# Altium schematic sheet ESP321_Sheet_1_updated_2.schdoc
size 599 x 426 mm; Name: A_A2; Symbol: A_A2; Device: A_A2; @Project Name: Review_2; REV: 1.0; Date: 2025-09-14; Sheet: 1/1; Draw By: hemakanth_n; Company: Grelien; Convert to PCB: yes; Add into BOM: yes; spicePre: .; @Page No: 1; @Page Count: 1; @Schematic Name: ESP32; @Board Name: ESP32; @Update Date: 2025-11-10; @Create Time: 06:48:16; @Update Time: 12:18:23; @Page Name: Sheet_1; @Create Date: 2025-11-10
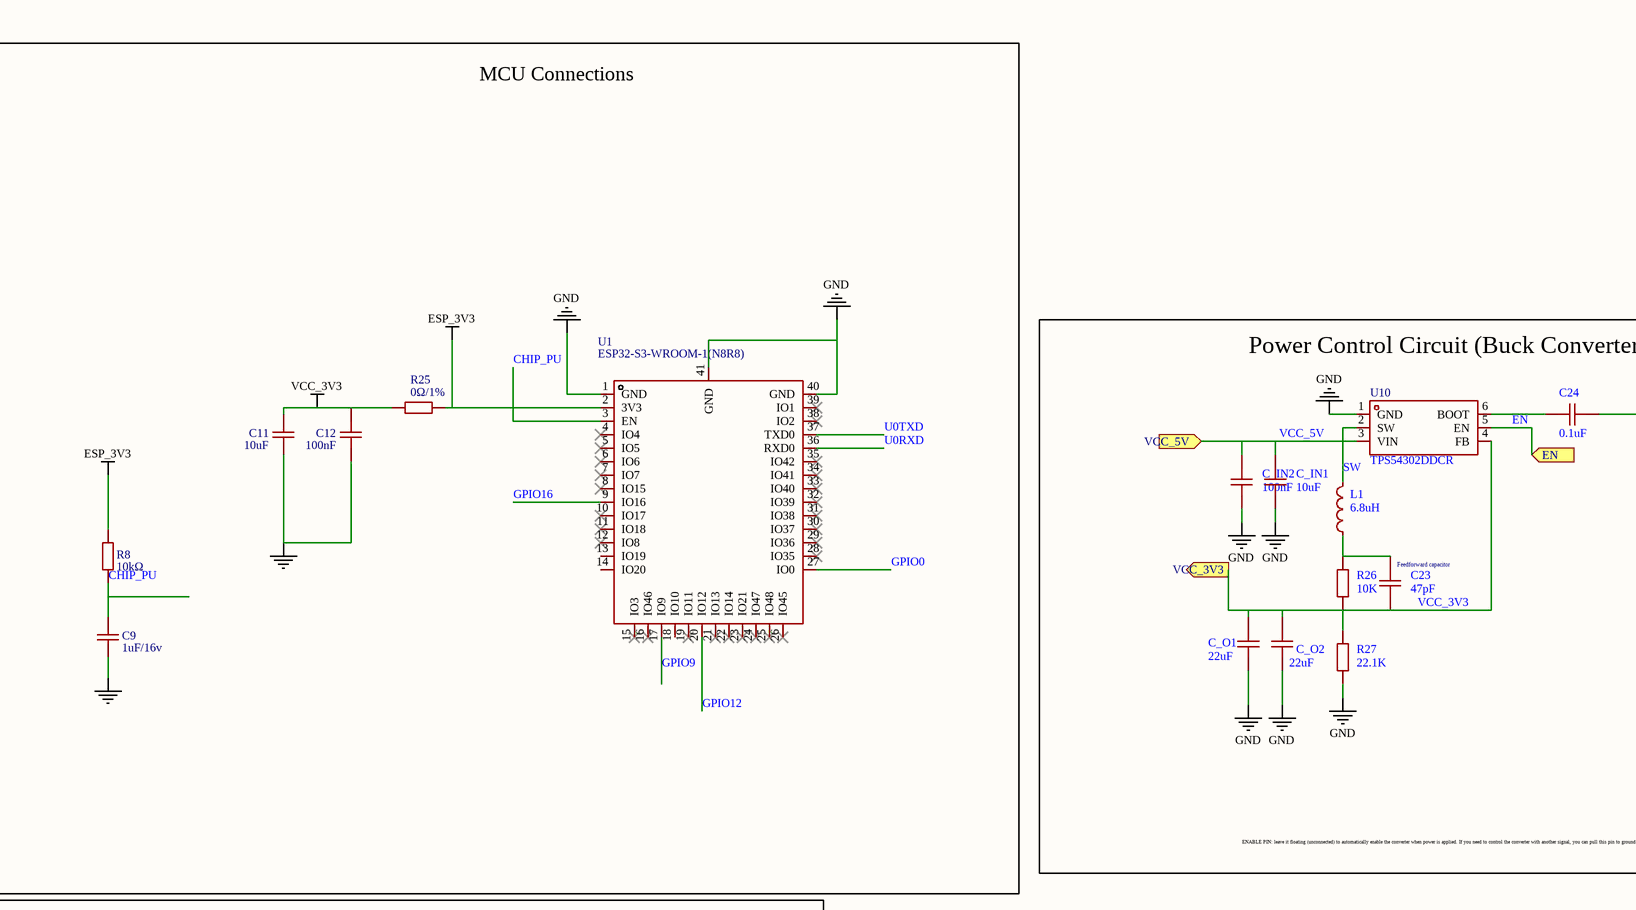
[diagram p0: ESP321_Sheet_1_updated_2.schdoc, top left]
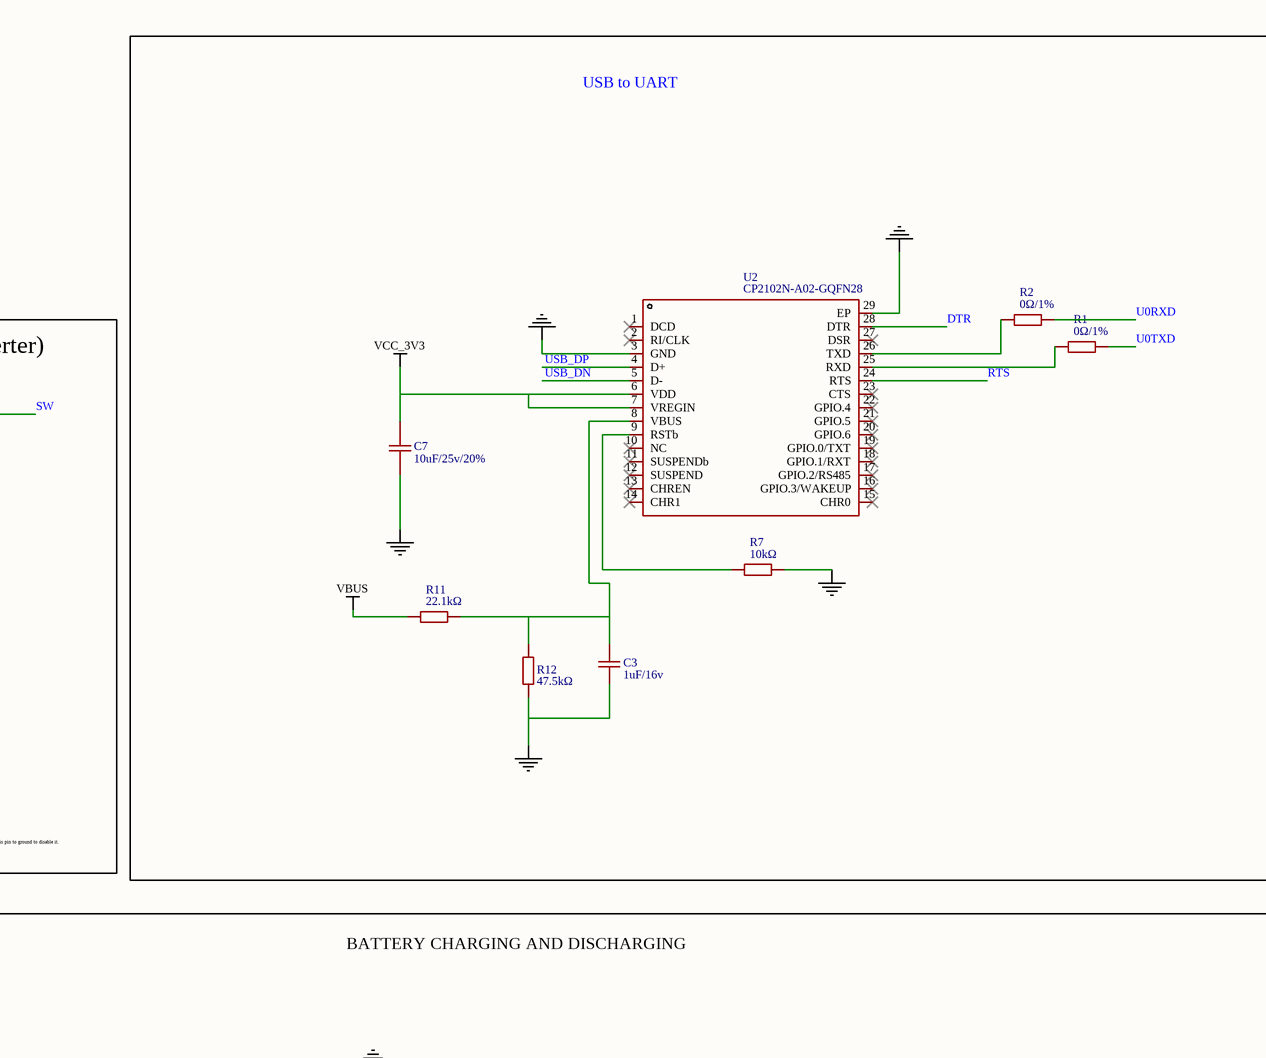
[diagram p1: ESP321_Sheet_1_updated_2.schdoc, top right]
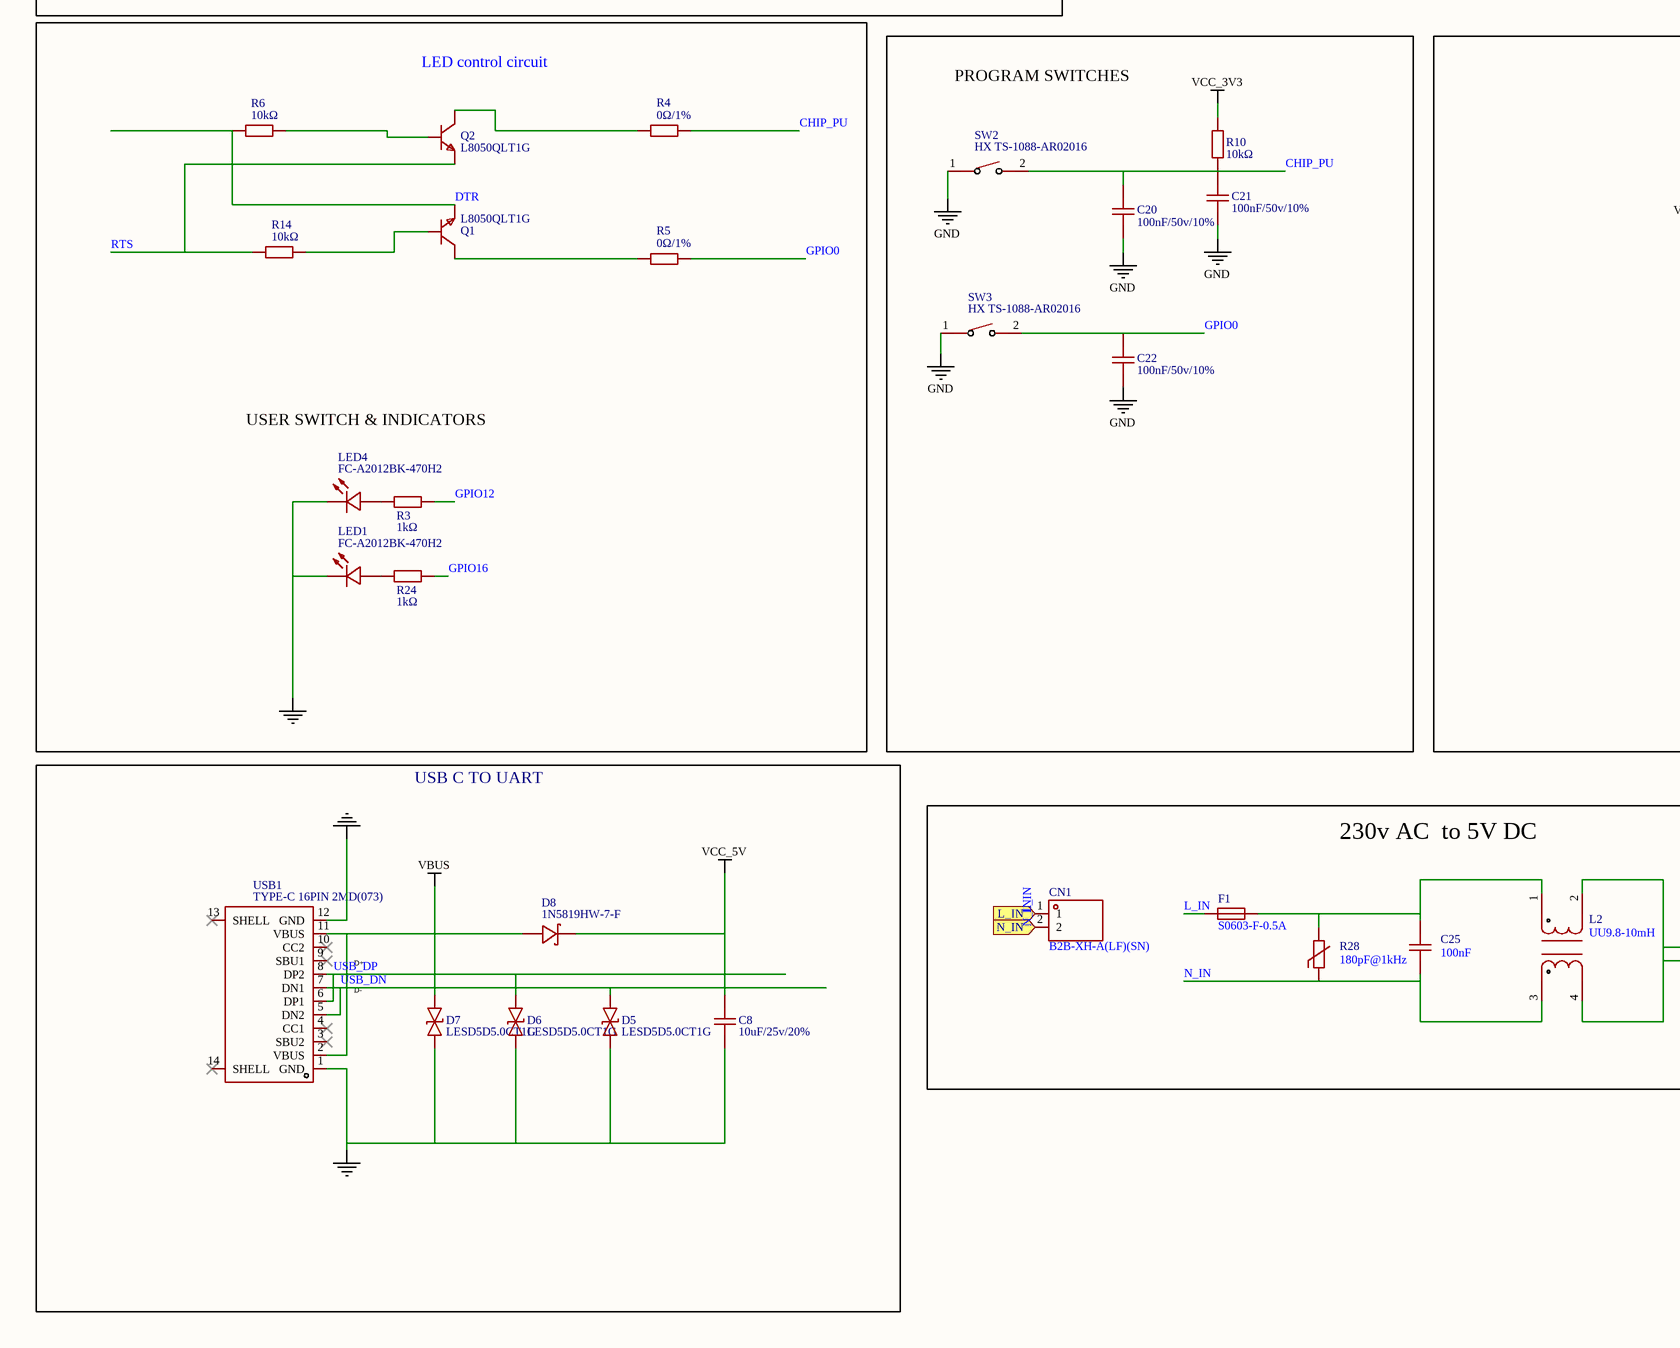
[diagram p2: ESP321_Sheet_1_updated_2.schdoc, bottom left]
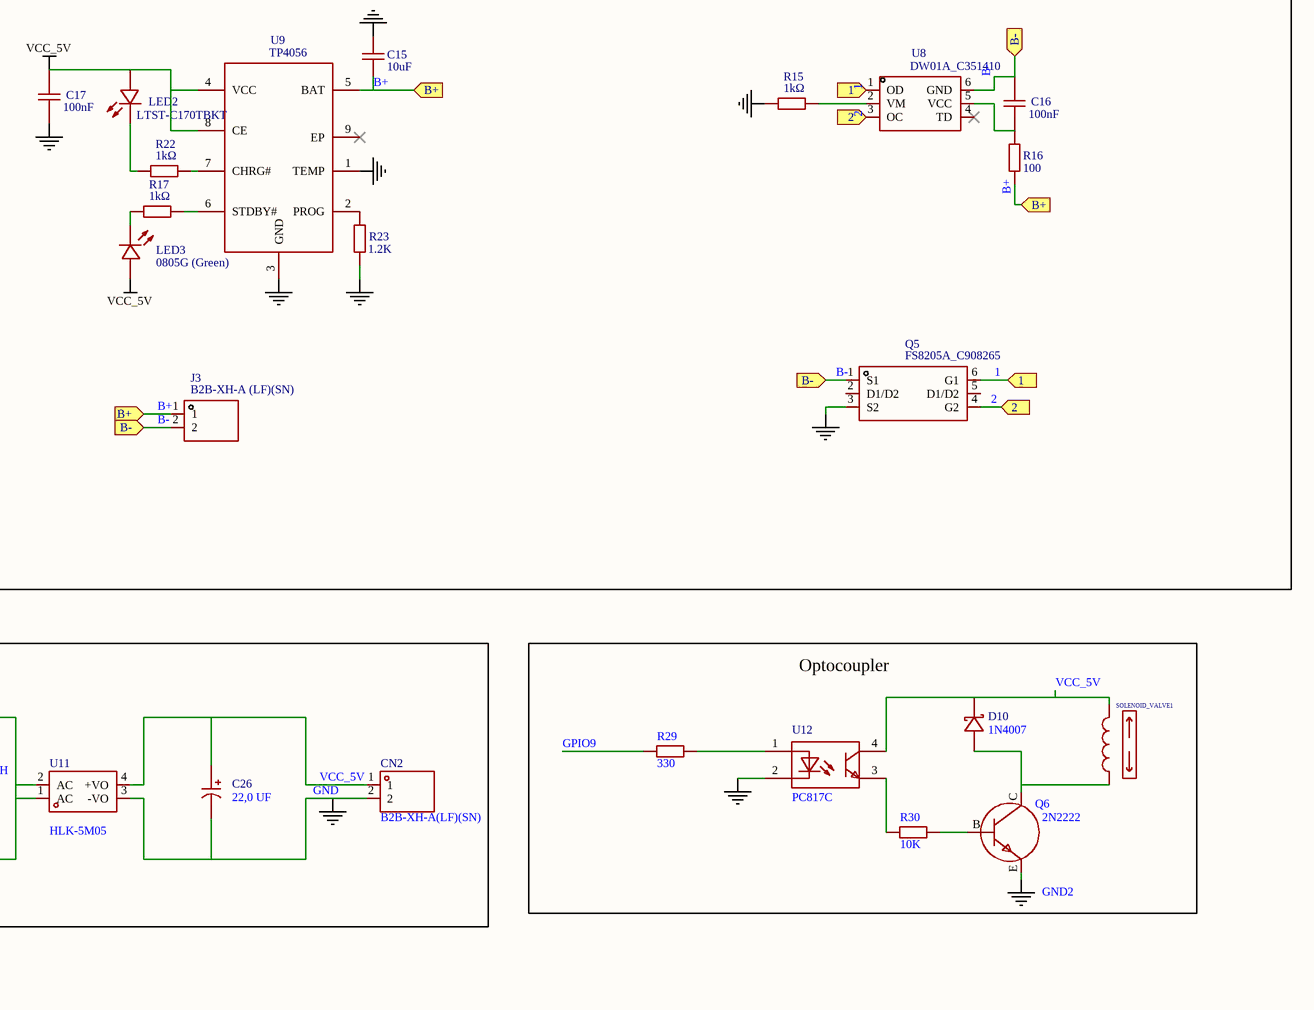
[diagram p3: ESP321_Sheet_1_updated_2.schdoc, bottom right]

## Parts
C3  1uF/16v  [C0402]
C7  10uF/25v/20%  [C0603]
C8  10uF/25v/20%  [C0603]
C9  1uF/16v  [C0402]
C11  10uF  [C0402]
C12  100nF  [C0402]
C15  10uF  [C0402]
C16  100nF  [C0402]
C17  100nF  [C0402]
C20  100nF/50v/10%  [C0402]
C21  100nF/50v/10%  [C0402]
C22  100nF/50v/10%  [C0402]
C23  47pF  [C0603]
C24  0.1uF  [C0603]
C25  100nF  [CAP-TH_L10.0-W5.0-P7.50-D0.6]
C26  22,0 UF  [CAP-TH_BD10.0-P5.00-D0.6-FD]
C_IN1  10uF  [C0603]
C_IN2  100nF  [C0603]
C_O1  22uF  [C0603]
C_O2  22uF  [C0603]
CN1  B2B-XH-A(LF)(SN)  [CONN-TH_B2B-XH-A-LF-SN]
CN2  B2B-XH-A(LF)(SN)  [CONN-TH_B2B-XH-A-LF-SN]
D5  LESD5D5.0CT1G  [SOD-523_L1.2-W0.8-LS1.6-BI]
D6  LESD5D5.0CT1G  [SOD-523_L1.2-W0.8-LS1.6-BI]
D7  LESD5D5.0CT1G  [SOD-523_L1.2-W0.8-LS1.6-BI]
D8  1N5819HW-7-F  [SOD-123_L2.7-W1.6-LS3.7-RD]
D10  1N4007  [SOD-57_BD3.8-L4.6-P9.00-D0.8-RD]
F1  S0603-F-0.5A  [F0603]
J3  B2B-XH-A (LF)(SN)  [CONN-TH_B2B-XH-A-LF-SN]
L1  6.8uH  [L0603]
L2  UU9.8-10mH  [FILTER-TH_4P-L16.5-W11.5-P8.00-D0.6-S7.00]
LED1  FC-A2012BK-470H2  [LED0805-R-RD]
LED2  LTST-C170TBKT  [LED0805-RD_BLUE]
LED3  0805G (Green)  [LED0805-RD_GREEN]
LED4  FC-A2012BK-470H2  [LED0805-R-RD]
Q1  L8050QLT1G  [SOT-23-3_L2.9-W1.3-P1.90-LS2.4-BR]
Q2  L8050QLT1G  [SOT-23-3_L2.9-W1.3-P1.90-LS2.4-BR]
Q5  FS8205A_C908265  [SOT-23-6_L2.9-W1.6-P0.95-LS2.8-BR]
Q6  2N2222  [TO-18]
R1  0Ω/1%  [R0402]
R2  0Ω/1%  [R0402]
R3  1kΩ  [R0402]
R4  0Ω/1%  [R0402]
R5  0Ω/1%  [R0402]
R6  10kΩ  [R0402]
R7  10kΩ  [R0402]
R8  10kΩ  [R0402]
R10  10kΩ  [R0402]
R11  22.1kΩ  [R0402]
R12  47.5kΩ  [R0402]
R14  10kΩ  [R0402]
R15  1kΩ  [R0402]
R16  100  [R0603]
R17  1kΩ  [R0402]
R22  1kΩ  [R0402]
R23  1.2K  [R0603]
R24  1kΩ  [R0402]
R25  0Ω/1%  [R0402]
R26  10K  [R0603]
R27  22.1K  [R0603]
R28  180pF@1kHz  [RES-SMD_10D561K]
R29  330  [R0603]
R30  10K  [R0603]
SOLENOID_VALVE1  (no value)
SW2  HX TS-1088-AR02016  [SW-SMD_L4.0-W2.9-LS5.0]
SW3  HX TS-1088-AR02016  [SW-SMD_L4.0-W2.9-LS5.0]
U1  ESP32-S3-WROOM-1(N8R8)  [WIRELM-SMD_ESP32-S3-WROOM-1]
U2  CP2102N-A02-GQFN28  [QFN-28_L5.0-W5.0-P0.50-TL-EP3.3]
U8  DW01A_C351410  [SOT-23-6_L2.9-W1.6-P0.95-LS2.8-BL]
U9  TP4056  [ESOP-8_L4.9-W3.9-P1.27-LS6.0-BL-EP]
U10  TPS54302DDCR  [SOT-23-6_L2.9-W1.6-P0.95-LS2.8-BL]
U11  HLK-5M05  [PWRM-TH_HLK-5M05]
U12  PC817C  [DIP-4_L4.6-W6.5-P2.54-LS7.6-BL]
USB1  TYPE-C 16PIN 2MD(073)  [USB-C-SMD_TYPE-C-6PIN-2MD-073]

## Blocks framed on the sheet
MCU Connections: C9 C11 C12 R8 R25 U1
USB to UART: C3 C7 R1 R2 R7 R11 R12 U2
Power Control Circuit (Buck Converter): C23 C24 C_IN1 C_IN2 C_O1 C_O2 L1 R26 R27 U10
USER SWITCH & INDICATORS: LED1 LED4 Q1 Q2 R3-R6 R14 R24
PROGRAM SWITCHES: C20-C22 R10 SW2 SW3
BATTERY CHARGING AND DISCHARGING: C15-C17 J3 LED2 LED3 Q5 R15-R17 R22 R23 U8 U9
USB C TO UART: C8 D5-D8 USB1
230v AC  to 5V DC: C25 C26 CN1 CN2 F1 L2 R28 U11
Optocoupler: D10 Q6 R29 R30 SOLENOID_VALVE1 U12

## Ports
1 (in), 2 (in), B+ (in), B- (in), EN (in), L_IN (in), N_IN (in), VCC_3V3 (out), VCC_5V (in)

## Nets
ESP_3V3: R8.2 R25.2 U1.2(3V3)
GND: C3.1 C7.1 C8.1 C9.1 C11.2 C12.1 C15.2 C17.1 C20.2 C21.2 C22.1 C26.2 C_IN1.2 C_IN2.2 C_O1.1 C_O2.2 CN2.2 D5.1 D6.1 D7.1 LED1.2(-) LED4.2(-) Q5.3(S2) Q6.E R7.2 R12.1 R15.1 R23.1 R27.1 SW2.1 SW3.1 U1.1(GND) U1.40(GND) U1.41(GND) U2.3(GND) U2.29(EP) U9.1(TEMP) U9.3(GND) U10.1(GND) U11.3(-VO) U12.2(CAT) USB1.1(GND) USB1.12(GND)
VBUS: D7.2 D8.2(A) R11.1 USB1.2(VBUS) USB1.11(VBUS)
VCC_3V3: C7.2 C11.1 C12.2 C23.2 C_O1.2 C_O2.1 R10.2 R25.1 R26.1 R27.2 U2.6(VDD) U2.7(VREGIN) U10.4(FB) ; port VCC_3V3
VCC_5V: C8.2 C17.2 C26.1 C_IN1.1 C_IN2.1 CN2.1 D8.1(K) D10.1(K) LED2.2(A) LED3.2(A) SOLENOID_VALVE1.1 U9.4(VCC) U9.8(CE) U10.3(VIN) U11.4(+VO) U12.4(COL) ; port VCC_5V
1: Q5.6(G1) U8.1(OD) ; port 1
2: Q5.4(G2) U8.3(OC) ; port 2
B+: C15.1 J3.1 R16.1 U9.5(BAT) ; port B+
B-: C16.2 J3.2 Q5.1(S1) U8.6(GND) ; port B-
CHIP_PU: C9.2 C20.1 C21.1 R4.2 R8.1 R10.1 SW2.2 U1.3(EN)
DTR: Q1.2(E) R6.1 U2.28(DTR)
EN: U10.5(EN) ; port EN
GPIO0: C22.2 R5.2 SW3.2 U1.27(IO0)
GPIO9: R29.1 U1.17(IO9)
GPIO12: R3.2 U1.20(IO12)
GPIO16: R24.2 U1.9(IO16)
L_IN: CN1.1 F1.1 ; port L_IN
N_IN: C25.1 CN1.2 L2.3 R28.1 ; port N_IN
RTS: Q2.2(E) R14.1 U2.24(RTS)
SW: C24.2 L1.2 U10.2(SW)
U0RXD: R2.2 U1.36(RXD0)
U0TXD: R1.2 U1.37(TXD0)
USB_DN: D5.2 U2.5(D-) USB1.5(DN2) USB1.7(DN1)
USB_DP: D6.2 U2.4(D+) USB1.6(DP1) USB1.8(DP2)
NetC3_2: C3.2 R11.2 R12.2 U2.8(VBUS)
NetC16_1: C16.1 R16.2 U8.5(VCC)
NetC23_1: C23.1 L1.1 R26.2
NetC24_1: C24.1 U10.6(BOOT)
NetC25_2: C25.2 F1.2 L2.1 R28.2
NetD10_2: D10.2(A) Q6.C SOLENOID_VALVE1.2
NetL2_2: L2.2 L2.4 U11.1(AC) U11.2(AC)
NetLED1_1: LED1.1(+) R24.1
NetLED2_1: LED2.1(K) R22.1
NetLED3_1: LED3.1(K) R17.1
NetLED4_1: LED4.1(+) R3.1
NetQ1_1: Q1.1(B) R14.2
NetQ1_3: Q1.3(C) R5.1
NetQ2_1: Q2.1(B) R6.2
NetQ2_3: Q2.3(C) R4.1
NetQ6_B: Q6.B R30.2
NetR1_1: R1.1 U2.25(RXD)
NetR2_1: R2.1 U2.26(TXD)
NetR7_1: R7.1 U2.9(RSTb)
NetR15_2: R15.2 U8.2(VM)
NetR17_2: R17.2 U9.6(STDBY#)
NetR22_2: R22.2 U9.7(CHRG#)
NetR23_2: R23.2 U9.2(PROG)
NetR29_2: R29.2 U12.1(AN)
NetR30_1: R30.1 U12.3(EM)

Not connected (* = marked no-connect by the designer): Q5 2(D1/D2) 5(D1/D2); U1 4(IO4)* 5(IO5)* 6(IO6)* 7(IO7)* 8(IO15)* 10(IO17)* 11(IO18)* 12(IO8)* 13(IO19) 14(IO20) 15(IO3)* 16(IO46)* 18(IO10) 19(IO11)* 21(IO13)* 22(IO14)* 23(IO21)* 24(IO47)* 25(IO48)* 26(IO45)* 28(IO35)* 29(IO36)* 30(IO37)* 31(IO38)* 32(IO39)* 33(IO40)* 34(IO41)* 35(IO42)* 38(IO2)* 39(IO1)*; U2 1(DCD)* 2(RI/CLK)* 10(NC)* 11(SUSPENDb)* 12(SUSPEND)* 13(CHREN)* 14(CHR1)* 15(CHR0)* 16(GPIO.3/WAKEUP)* 17(GPIO.2/RS485)* 18(GPIO.1/RXT)* 19(GPIO.0/TXT)* 20(GPIO.6)* 21(GPIO.5)* 22(GPIO.4)* 23(CTS)* 27(DSR)*; U8 4(TD)*; U9 9(EP)*; USB1 3(SBU2)* 4(CC1)* 9(SBU1)* 10(CC2)* 13(SHELL)* 14(SHELL)*

## Notes on the sheet
- (near C23) Feedforward capacitor
- ENABLE PIN: leave it floating (unconnected) to automatically enable the converter when power is applied. If you need to control the converter with another signal, you can pull this pin to ground to disable it.
- (near Q2) LED control circuit
- (near USB1) D+
- (near USB1) D-
- (near Q6) GND2
- Convert to PCB
- Add into BOM
- 1
- 2
- 3
- 4
- 5
- 6
- 7
- 8
- 9
- 10
- 11
- A
- B
- C
- D
- E
- F
- G
- H
- TITLE:
- Review_2
- REV:
- 1.0
- Date:
- Company:
- 2025-09-14
- Grelien
- Drawn By:
- hemakanth_n
- Sheet:
- 1/1

## Library data of the parts
C3 C9 = 1uF/16v: Manufacturer Part: CL05A105KO5NNNC; Manufacturer: SAMSUNG(三星); Convert to PCB: yes; nameAlias: Value; Symbol: 1uF/16v; Device: 1uF/16v; Supplier: LCSC; Supplier Part: C29266; JLCPCB Part Class: Extended Part; Add into BOM: yes; Origin Footprint: C0402; spicePre: C; spiceSymbolName: CL05A105KO5NNNC
C7 C8 = 10uF/25v/20%: Manufacturer: SAMSUNG(三星); Manufacturer Part: CL10A106MA8NRNC; Convert to PCB: yes; nameAlias: Value; Symbol: 10uF/25v/20%; Device: 10uF/25v/20%; Supplier: LCSC; Supplier Part: C96446; JLCPCB Part Class: Basic Part; Add into BOM: yes; Origin Footprint: C0603; spicePre: C; spiceSymbolName: CL10A106MA8NRNC
C11 C15 = 10uF: Manufacturer Part: CL05A106MQ5NUNC; Manufacturer: SAMSUNG(三星); Convert to PCB: yes; nameAlias: Value; Symbol: 10uF; Device: 10uF; Supplier: LCSC; Supplier Part: C15525; JLCPCB Part Class: Basic Part; Add into BOM: yes; Origin Footprint: C0402; spicePre: C; spiceSymbolName: CL05A106MQ5NUNC
C12 C16 C17 = 100nF: Manufacturer Part: CL05B104KO5NNNC; Manufacturer: SAMSUNG(三星); Convert to PCB: yes; nameAlias: Value; Symbol: 100nF; Device: 100nF; Supplier: LCSC; Supplier Part: C1525; JLCPCB Part Class: Basic Part; Add into BOM: yes; Origin Footprint: C0402; spicePre: C; spiceSymbolName: CL05B104KO5NNNC
C20-C22 = 100nF/50v/10%: Manufacturer: SAMSUNG(三星); Manufacturer Part: CL05B104KB54PNC; Convert to PCB: yes; nameAlias: Value; Contributor: LCSC; Symbol: 100nF/50v/10%; Device: 100nF/50v/10%; Supplier: LCSC; Supplier Part: C307331; JLCPCB Part Class: Basic Part; Add into BOM: yes; Origin Footprint: C0402; spicePre: C; spiceSymbolName: CL05B104KB54PNC
C23 C24 C_IN1 C_IN2 C_O1 C_O2 = CAP_0603: Symbol: CAP; Convert to PCB: yes; Device: CAP_0603; Add into BOM: yes; Supplier Footprint: 0603
  C23: Value: 47pF
  C24: Value: 0.1uF
  C_IN1: Value: 10uF
  C_IN2: Value: 100nF
  C_O1 C_O2: Value: 22uF
C25 = X2-104K-275VAC: Manufacturer: NDF(达孚); Add into BOM: yes; Tolerance: ±10%; Voltage(AC): 275V; Ratings: X2; Symbol: X2-104K-275VAC; Device: X2-104K-275VAC; LCSC Part Name: 等级:X2 100nF ±10% 275V; Supplier Part: C914482; Manufacturer Part: X2-104K-275VAC; Supplier Footprint: 插件,P=7.5mm; JLCPCB Part Class: Extended Part; Datasheet: https://item.szlcsc.com/datasheet/X2-104K-275VAC/985380.html; Supplier: LCSC; Convert to PCB: yes; Value: 100nF; Operating Temperature: -40℃~+110℃
C26 = BIPOLAR CAPACITOR 22,0 UF: Manufacturer: Visaton; Add into BOM: yes; Symbol: BIPOLAR CAPACITOR 22,0 UF; Device: BIPOLAR CAPACITOR 22,0 UF; LCSC Part Name: BIPOLAR CAPACITOR 22,0 UF; Supplier Part: C6131732; Manufacturer Part: 22,0 UF; Supplier Footprint: 插件,D10xL25.5mm; JLCPCB Part Class: Extended Part; Supplier: LCSC; Convert to PCB: yes
CN1 CN2 = B2B-XH-A(LF)(SN): Manufacturer: JST; Add into BOM: yes; Pins Structure: 1x2P; Pitch: 2.5mm; Reference Series: XH; Number of PINs Per Row: 2; Current Rating: 3A; Voltage Rating: 250V; Plastic Material: PA66; Flame Retardant Rating: UL94V-0; Supplementary Features: K Pin; Z-Height of the Board: 7mm; X-Length of Bottom Edge on Board (Spacing Line): 7.4mm; Y-Width of Bottom Edge on Board: 5.75mm; Symbol: B2B-XH-A (LF)(SN); Device: B2B-XH-A(LF)(SN); LCSC Part Name: 1x2P 间距:2.5mm 直插 系列:XH; Supplier Part: C158012; Manufacturer Part: B2B-XH-A(LF)(SN); Supplier Footprint: 插件,P=2.5mm; JLCPCB Part Class: Extended Part; Datasheet: https://item.szlcsc.com/datasheet/B2B-XH-A(LF)(SN)/169360.html; Supplier: LCSC; Convert to PCB: yes; Mounting Type: Through Hole; Number of Pins: 2P; Number of Rows: 1; Row Spacing: -; Contact Material: Brass; Contact Plating: Tin; Operating Temperature: -25℃~+85℃; Color: White
D5-D7 = LESD5D5.0CT1G: Manufacturer: LRC(乐山无线电); Convert to PCB: yes; Contributor: LCSC; Symbol: LESD5D5.0CT1G; Device: LESD5D5.0CT1G; Supplier: LCSC; Supplier Part: C383211; Manufacturer Part: LESD5D5.0CT1G; JLCPCB Part Class: Extended Part; Add into BOM: yes; Origin Footprint: SOD-523_L1.2-W0.8-LS1.6-BI; spicePre: D; spiceSymbolName: LESD5D5.0CT1G
D8 = 1N5819HW-7-F: Manufacturer: DIODES(美台); Convert to PCB: yes; Symbol: 1N5819HW-7-F; Device: 1N5819HW-7-F; Supplier: LCSC; Manufacturer Part: 1N5819HW-7-F; Supplier Part: C82544; JLCPCB Part Class: Extended Part; Add into BOM: yes; Origin Footprint: SOD-123_L2.7-W1.6-LS3.7-RD; spicePre: D; spiceSymbolName: 1N5819HW-7-F
D10 = SMA_DIODE: Add into BOM: yes; Symbol: SMA_DIODE; Device: SMA_DIODE; LCSC Part Name: SMA_DIODE; Supplier Part: C9900013997; Manufacturer Part: 1N4007; Supplier Footprint: 1N4007_SMADIODE; JLCPCB Part Class: Extended Part; Supplier: LCSC; Convert to PCB: yes
F1 = S0603-F-0.5A: Manufacturer: SART(萨特); Add into BOM: yes; Symbol: S0603-F-0.5A; Device: S0603-F-0.5A; LCSC Part Name: 0.5A 32V 快断; Supplier Part: C845152; Manufacturer Part: S0603-F-0.5A; Supplier Footprint: 0603; JLCPCB Part Class: Extended Part; Datasheet: https://atta.szlcsc.com/upload/public/pdf/source/20200518/C553909_B3C1DBB45E7AEF4D2D2BE7818720BF0B.pdf; Supplier: LCSC; Convert to PCB: yes
J3 = B2B-XH-A (LF)(SN): Manufacturer: JST; Convert to PCB: yes; Contributor: LCSC; Symbol: B2B-XH-A (LF)(SN); Device: B2B-XH-A (LF)(SN); Supplier: LCSC; Supplier Part: C158012; Manufacturer Part: B2B-XH-A(LF)(SN); JLCPCB Part Class: Extended Part; Add into BOM: yes; Origin Footprint: CONN-TH_B2B-XH-A-LF-SN; spicePre: C; spiceSymbolName: B2B-XH-A (LF)(SN)
L1 = L_0603: Symbol: 电感; Add into BOM: yes; Device: L_0603; Supplier Footprint: L0603; Convert to PCB: yes; Value: 6.8uH
L2 = UU9.8-10mH_C41416373: Manufacturer: SXN(顺翔诺); Add into BOM: yes; Number of Lines: 2; Voltage Withstand: 1.5kV@AC; DC Resistance(DCR): 900mΩ; Symbol: UU9.8-10MH_C41416373; Device: UU9.8-10mH_C41416373; LCSC Part Name: 10mH; Supplier Part: C41416373; Manufacturer Part: UU9.8-10mH; Supplier Footprint: 插件-4P,16.5x11.5mm; JLCPCB Part Class: Extended Part; Datasheet: https://item.szlcsc.com/datasheet/UU9.8-10mH/43238314.html; Supplier: LCSC; Convert to PCB: yes; Current Rating: -; Impedance @ Frequency: -; Voltage Rating - DC: -; Voltage Rating (AC): -; Inductance @ Frequency: -; Operating Temperature: -
LED1 LED4 = FC-A2012BK-470H2: Manufacturer: 国星光电; Manufacturer Part: NCD0805B2; Convert to PCB: yes; Symbol: FC-A2012BK-470H2; Device: FC-A2012BK-470H2; Supplier: LCSC; Supplier Part: C84259; JLCPCB Part Class: Extended Part; Add into BOM: yes; Origin Footprint: LED0805-R-RD; spicePre: L; spiceSymbolName: FC-A2012BK-470H2
LED2 = LTST-C170TBKT: Manufacturer: LITEON; Convert to PCB: yes; Contributor: LCSC; Symbol: LTST-C170TBKT; Device: LTST-C170TBKT; Supplier: LCSC; Manufacturer Part: LTST-C170TBKT; Supplier Part: C98222; Add into BOM: yes; Origin Footprint: LED0805-RD_BLUE; spicePre: L; spiceSymbolName: LTST-C170TBKT
LED3 = 0805G (Green): Manufacturer: KENTO; Convert to PCB: yes; Symbol: 0805G (Green); Device: 0805G (Green); Supplier: LCSC; Manufacturer Part: 0805G (Green); Supplier Part: C2297; JLCPCB Part Class: Basic Part; Add into BOM: yes; Origin Footprint: LED0805-RD_GREEN; spicePre: L; spiceSymbolName: 0805G (Green)
Q1 Q2 = L8050QLT1G: Manufacturer: LRC(乐山无线电); Convert to PCB: yes; Symbol: L8050QLT1G; Device: L8050QLT1G; Supplier: LCSC; Manufacturer Part: L8050QLT1G; Supplier Part: C49581; JLCPCB Part Class: Extended Part; Add into BOM: yes; Origin Footprint: SOT-23-3_L2.9-W1.3-P1.90-LS2.4-BR; spicePre: Q; spiceSymbolName: L8050QLT1G
Q5 = FS8205A_C908265: Manufacturer: FUXINSEMI(富芯森美); Convert to PCB: yes; Contributor: LCSC; Symbol: FS8205A_C908265; Device: FS8205A_C908265; JLCPCB Part Class: Extended Part; Supplier: LCSC; Supplier Part: C908265; Manufacturer Part: FS8205A; Add into BOM: yes; Origin Footprint: SOT-23-6_L2.9-W1.6-P0.95-LS2.8-BR; spicePre: Q; spiceSymbolName: FS8205A_C908265
Q6 = 2N2222: Manufacturer #1: MOTOROLA; Add into BOM: yes; Symbol: 2N2222; Device: 2N2222; Convert to PCB: yes; OldName: 2N2222; Part Number: 2N2222; PCB DECAL: TO-18
R1 R2 R4 R5 R25 = 0Ω/1%: Manufacturer: UNI-ROYAL(厚声); Manufacturer Part: 0402WGF0000TCE; Convert to PCB: yes; nameAlias: Value; Symbol: 0Ω/1%; Device: 0Ω/1%; Supplier: LCSC; Supplier Part: C17168; JLCPCB Part Class: Basic Part; Add into BOM: yes; Origin Footprint: R0402; spicePre: R; spiceSymbolName: 0402WGF0000TCE
R3 R15 R17 R22 R24 = 1kΩ: Manufacturer: UNI-ROYAL(厚声); Manufacturer Part: 0402WGF1001TCE; Convert to PCB: yes; nameAlias: Value; Symbol: 1kΩ; Device: 1kΩ; Supplier: LCSC; Supplier Part: C11702; JLCPCB Part Class: Basic Part; Add into BOM: yes; Origin Footprint: R0402; spicePre: R; spiceSymbolName: 0402WGF1001TCE
R6-R8 R10 R14 = 10kΩ: Manufacturer: UNI-ROYAL(厚声); Manufacturer Part: 0402WGF1002TCE; Convert to PCB: yes; nameAlias: Value; Symbol: 10kΩ; Device: 10kΩ; Supplier: LCSC; Supplier Part: C25744; JLCPCB Part Class: Basic Part; Add into BOM: yes; Origin Footprint: R0402; spicePre: R; spiceSymbolName: 0402WGF1002TCE
R11 = 22.1kΩ: Manufacturer: UNI-ROYAL(厚声); Manufacturer Part: 0402WGF2212TCE; Convert to PCB: yes; nameAlias: Value; Symbol: 22.1kΩ; Device: 22.1kΩ; Supplier: LCSC; Supplier Part: C43473; JLCPCB Part Class: Extended Part; Add into BOM: yes; Origin Footprint: R0402; spicePre: R; spiceSymbolName: 0402WGF2212TCE
R12 = 47.5kΩ: Manufacturer: UNI-ROYAL(厚声); Manufacturer Part: 0402WGF4752TCE; Convert to PCB: yes; nameAlias: Value; Symbol: 47.5kΩ; Device: 47.5kΩ; Supplier: LCSC; Supplier Part: C25896; JLCPCB Part Class: Extended Part; Add into BOM: yes; Origin Footprint: R0402; spicePre: R; spiceSymbolName: 0402WGF4752TCE
R16 = 100: Manufacturer: ResistorToday; Manufacturer Part: AECR0603F100RK9; Convert to PCB: yes; nameAlias: Resistance (Ohms); Contributor: LCSC; Symbol: 100; Device: 100; Supplier: LCSC; Supplier Part: C328334; JLCPCB Part Class: Extended Part; Add into BOM: yes; Origin Footprint: R0603; spicePre: R; spiceSymbolName: AECR0603F100RK9
R23 = 1.2K: Manufacturer: Tyohm; Manufacturer Part: RMC06031.2K5%N; Convert to PCB: yes; nameAlias: Resistance (Ohms); Contributor: LCSC; Symbol: 1.2K; Device: 1.2K; Supplier: LCSC; Supplier Part: C269681; JLCPCB Part Class: Extended Part; Add into BOM: yes; Origin Footprint: R0603; spicePre: R; spiceSymbolName: RMC06031.2K5%N
R26 R27 R29 R30 = Res_0603: Symbol: Res; Convert to PCB: yes; Device: Res_0603; Add into BOM: yes; Supplier Footprint: 0603
  R26 R30: Value: 10K
  R27: Value: 22.1K
  R29: Value: 330
R28 = 10D561K_C2959799: Manufacturer: SURGING(绍鑫); Add into BOM: yes; Varistor Voltage: 560V; Clamping Voltage: 925V; Maximum DC Volts: 460V; Maximum AC Volts: 350V; Peak Current: 2.5kA; Energy: 70J; Rated Wattage: 400mW; Symbol: 10D561K_C2959799; Device: 10D561K_C2959799; LCSC Part Name: 钳位电压925V 70焦耳 贴片压敏电阻; Supplier Part: C2959799; Manufacturer Part: 10D561K; Supplier Footprint: SMD; JLCPCB Part Class: Extended Part; Datasheet: https://item.szlcsc.com/datasheet/10D561K/3346335.html; Supplier: LCSC; Convert to PCB: yes; Value: 180pF@1kHz
SOLENOID_VALVE1 = SOLENOID: Convert to PCB: yes; Symbol: SOLENOID; Device: SOLENOID; Add into BOM: yes
SW2 SW3 = HX TS-1088-AR02016: Manufacturer: hanxia(韩下); Convert to PCB: yes; Contributor: lcsc; Symbol: HX TS-1088-AR02016; Device: HX TS-1088-AR02016; Supplier: LCSC; Supplier Part: C36498961; Manufacturer Part: HX TS-1088-AR02016; JLCPCB Part Class: Extended Part; Add into BOM: yes; Origin Footprint: SW-SMD_L4.0-W2.9-LS5.0; spicePre: S; spiceSymbolName: HX TS-1088-AR02016
U1 = ESP32-S3-WROOM-1(N8R8): Manufacturer: ESPRESSIF(乐鑫); Manufacturer Part: ESP32-S3-WROOM-1-N8R8; Convert to PCB: yes; Contributor: LCSC; Symbol: ESP32-S3-WROOM-1(N8R8); Device: ESP32-S3-WROOM-1(N8R8); Supplier: LCSC; Supplier Part: C2913201; JLCPCB Part Class: Extended Part; Add into BOM: yes; Origin Footprint: WIRELM-SMD_ESP32-S3-WROOM-1; spicePre: U; spiceSymbolName: ESP32-S3-WROOM-1(N8R8)
U2 = CP2102N-A02-GQFN28: Manufacturer: SKYWORKS/SILICON LABS(芯科); Convert to PCB: yes; Contributor: LCSC; Symbol: CP2102N-A02-GQFN28; Device: CP2102N-A02-GQFN28; Supplier: LCSC; Supplier Part: C1550553; Manufacturer Part: CP2102N-A02-GQFN28; JLCPCB Part Class: Extended Part; Add into BOM: yes; Origin Footprint: QFN-28_L5.0-W5.0-P0.50-TL-EP3.3; spicePre: U; spiceSymbolName: CP2102N-A02-GQFN28
U8 = DW01A_C351410: Manufacturer: PUOLOP; Manufacturer Part: DW01A; Convert to PCB: yes; Contributor: LCSC; Symbol: DW01A_C351410; Device: DW01A_C351410; Supplier: LCSC; Supplier Part: C351410; JLCPCB Part Class: Extended Part; Add into BOM: yes; Origin Footprint: SOT-23-6_L2.9-W1.6-P0.95-LS2.8-BL; spicePre: U; spiceSymbolName: DW01A_C351410
U9 = TP4056: Manufacturer: TOPPOWER; Convert to PCB: yes; Contributor: Guest; Symbol: TP4056; Device: TP4056; Supplier: LCSC; Manufacturer Part: TP4056; Supplier Part: C16581; JLCPCB Part Class: Basic Part; Add into BOM: yes; Origin Footprint: ESOP-8_L4.9-W3.9-P1.27-LS6.0-BL-EP; spicePre: U; spiceSymbolName: TP4056
U10 = TPS54302DDCR_C311983: Manufacturer: TI(德州仪器); Add into BOM: yes; Function: Step-down type; Output Type: Fixed; Input Voltage: 4.5V~28V; Output Voltage: 5V; Output Current: 3A; Switching Frequency: 400kHz; Number of Outputs: 1; Topology: Step-down; Quiescent Current (Iq): 45uA; Switch tube (built-in/external): Built-in; Symbol: TPS54302DDCR_C311983; Device: TPS54302DDCR_C311983; LCSC Part Name: 4.5V至28V输入、3A输出、EMI友好的同步降压转换器; Supplier Part: C311983; Manufacturer Part: TPS54302DDCR; Supplier Footprint: TSOT-23-6; JLCPCB Part Class: Extended Part; Datasheet: https://www.ti.com/cn/lit/gpn/tps54302; Supplier: LCSC; Convert to PCB: yes; Operating Temperature: -40℃~+125℃; Synchronous Rectification: Yes
U11 = HLK-5M05_C209907: Manufacturer: HI-LINK(海凌科); Add into BOM: yes; Conversion Type: AC/DC-DC; Voltage - Input(DC): 70V~350V; Voltage - Input(AC): 85VAC~264VAC; Output Voltage: 5V; Output Voltage Accuracy: ±0.2%; Output Current(Max): 1A; Output Power: 5W; Quiescent Dissipation: 0.1W; Conversion Efficiency: 70%; Ripple Noise: 50mVp-p; Isolation Voltage(Vrms): 3kV; Symbol: HLK-5M05; Device: HLK-5M05_C209907; LCSC Part Name: 5W超小型系列模块电源; Supplier Part: C209907; Manufacturer Part: HLK-5M05; Supplier Footprint: DIP,38x23mm; JLCPCB Part Class: Extended Part; Datasheet: https://item.szlcsc.com/datasheet/HLK-5M05/210985.html; Supplier: LCSC; Convert to PCB: yes; Features: Over Current Protection；Short Circuit Protection; Length: 38mm; Width: 23mm; Height: 18mm
U12 = PC817C_C20612449: Manufacturer: KTP(科泰普); Add into BOM: yes; Output Type: Phototransistor; Voltage - Forward(Vf): 1.2V; Output Current: 50mA; Isolation Voltage(Vrms): 5kV; Reverse Voltage: 6V; Load Voltage: 35V; Number of Outputs: 1; Vce Saturation(VCE(sat)): 100mV@20mA,1mA; Rise time: 18us; Current Transfer Ratio (CTR) Minimum: 200%; Current Transfer Ratio (CTR) Maximum/Saturation Value: 400%; Symbol: PC817C_C20612449; Device: PC817C_C20612449; LCSC Part Name: PC817C; Supplier Part: C20612449; Manufacturer Part: PC817C; Supplier Footprint: DIP-4; JLCPCB Part Class: Extended Part; Datasheet: https://item.szlcsc.com/datasheet/PC817C/21971288.html; Supplier: LCSC; Convert to PCB: yes; Input voltage type: -; Fall time: 18us; Operating Temperature: -55℃~+110℃
USB1 = TYPE-C 16PIN 2MD(073): Manufacturer: SHOU HAN(首韩); Convert to PCB: yes; Contributor: LCSC; Symbol: TYPE-C 16PIN 2MD(073); Device: TYPE-C 16PIN 2MD(073); Supplier: LCSC; Supplier Part: C2765186; Manufacturer Part: TYPE-C 16PIN 2MD(073); JLCPCB Part Class: Extended Part; Add into BOM: yes; Origin Footprint: USB-C-SMD_TYPE-C-6PIN-2MD-073; spicePre: U; spiceSymbolName: TYPE-C 16PIN 2MD(073)